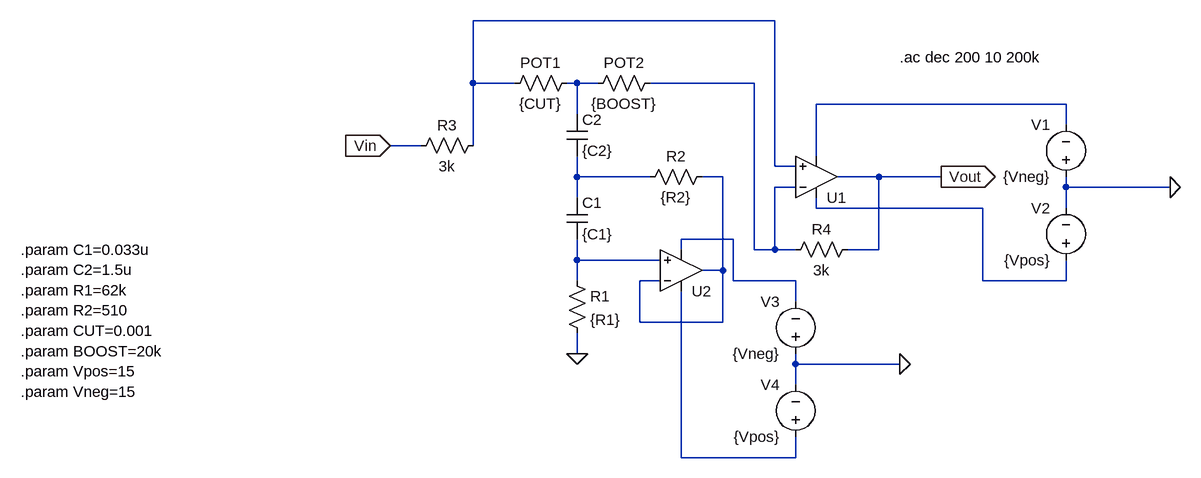
[diagram p0: schematic Equaliser.asc]
Equaliser.asc, the LTspice schematic file:
Version 4.1
SHEET 1 1188 680
WIRE 560 -96 96 -96
WIRE 96 0 96 -96
WIRE 160 0 96 0
WIRE 256 0 240 0
WIRE 288 0 256 0
WIRE 528 0 368 0
WIRE 1008 32 624 32
WIRE 256 48 256 0
WIRE 1008 64 1008 32
WIRE 16 96 -32 96
WIRE 96 96 96 0
WIRE 624 112 624 32
WIRE 560 128 560 -96
WIRE 592 128 560 128
WIRE 256 144 256 112
WIRE 368 144 256 144
WIRE 480 144 448 144
WIRE 720 144 656 144
WIRE 816 144 720 144
WIRE 592 160 560 160
WIRE 1008 160 1008 144
WIRE 1168 160 1008 160
WIRE 256 176 256 144
WIRE 624 192 624 176
WIRE 880 192 624 192
WIRE 1008 192 1008 160
WIRE 496 240 416 240
WIRE 416 256 416 240
WIRE 528 256 528 0
WIRE 560 256 560 160
WIRE 560 256 528 256
WIRE 592 256 560 256
WIRE 720 256 720 144
WIRE 720 256 672 256
WIRE 256 272 256 240
WIRE 384 272 256 272
WIRE 480 288 480 144
WIRE 480 288 448 288
WIRE 256 304 256 272
WIRE 384 304 352 304
WIRE 496 304 496 240
WIRE 592 304 496 304
WIRE 880 304 880 192
WIRE 1008 304 1008 272
WIRE 1008 304 880 304
WIRE 592 336 592 304
WIRE 352 368 352 304
WIRE 480 368 480 288
WIRE 480 368 352 368
WIRE 256 416 256 384
WIRE 592 432 592 416
WIRE 752 432 592 432
WIRE 592 464 592 432
WIRE 416 576 416 320
WIRE 592 576 592 544
WIRE 592 576 416 576
FLAG -32 96 Vin
IOPIN -32 96 In
FLAG 816 144 Vout
IOPIN 816 144 Out
FLAG 1168 160 0
FLAG 752 432 0
FLAG 256 416 0
SYMBOL res 112 80 R90
WINDOW 0 0 56 VBottom 2
WINDOW 3 32 56 VTop 2
SYMATTR InstName R3
SYMATTR Value 3k
SYMBOL res 256 -16 R90
WINDOW 0 0 56 VBottom 2
WINDOW 3 32 56 VTop 2
SYMATTR InstName POT1
SYMATTR Value {CUT}
SYMBOL res 384 -16 R90
WINDOW 0 0 56 VBottom 2
WINDOW 3 32 56 VTop 2
SYMATTR InstName POT2
SYMATTR Value {BOOST}
SYMBOL cap 240 48 R0
SYMATTR InstName C2
SYMATTR Value {C2}
SYMBOL cap 240 176 R0
SYMATTR InstName C1
SYMATTR Value {C1}
SYMBOL res 240 288 R0
SYMATTR InstName R1
SYMATTR Value {R1}
SYMBOL res 464 128 R90
WINDOW 0 0 56 VBottom 2
WINDOW 3 32 56 VTop 2
SYMATTR InstName R2
SYMATTR Value {R2}
SYMBOL OpAmps\\UniversalOpAmp2 416 288 M180
SYMATTR InstName U2
SYMATTR Value2 Avol=1Meg GBW=55Meg Slew=20
SYMATTR SpiceLine Ilimit=25m Rail=0.2 Vos=0.2m
SYMATTR SpiceLine2 En=2.7n Enk=20 In=0.4p Ink=100 Rin=1e9
SYMBOL OpAmps\\UniversalOpAmp2 624 144 M180
SYMATTR InstName U1
SYMATTR Value2 Avol=1Meg GBW=55Meg Slew=20
SYMATTR SpiceLine Ilimit=25m Rail=0.2 Vos=0.2m
SYMATTR SpiceLine2 En=2.7n Enk=20 In=0.4p Ink=100 Rin=1e9
SYMBOL res 688 240 R90
WINDOW 0 0 56 VBottom 2
WINDOW 3 32 56 VTop 2
SYMATTR InstName R4
SYMATTR Value 3k
SYMBOL voltage 1008 160 R180
WINDOW 0 24 96 Left 2
WINDOW 3 24 16 Left 2
SYMATTR InstName V1
SYMATTR Value {Vneg}
SYMBOL voltage 1008 288 R180
WINDOW 0 24 96 Left 2
WINDOW 3 24 16 Left 2
SYMATTR InstName V2
SYMATTR Value {Vpos}
SYMBOL voltage 592 432 R180
WINDOW 0 24 96 Left 2
WINDOW 3 24 16 Left 2
SYMATTR InstName V3
SYMATTR Value {Vneg}
SYMBOL voltage 592 560 R180
WINDOW 0 24 96 Left 2
WINDOW 3 24 16 Left 2
SYMATTR InstName V4
SYMATTR Value {Vpos}
TEXT 752 -40 Left 2 !.ac dec 200 10 200k
TEXT -600 256 Left 2 !.param C1=0.033u\n.param C2=1.5u\n.param R1=62k\n.param R2=510\n.param CUT=0.001\n.param BOOST=20k\n.param Vpos=15\n.param Vneg=15

The netlist it stands for:
* Equaliser.asc
R3 N001 Vin 3k
R§POT1 N002 N001 {CUT}
R§POT2 N003 N002 {BOOST}
C2 N002 N005 {C2}
C1 N005 N009 {C1}
R1 N009 0 {R1}
R2 N006 N005 {R2}
X§U2 N009 N006 N010 N008 N006 level2 Avol=1Meg GBW=55Meg Slew=20 Ilimit=25m Rail=0.2 Vos=0.2m En=2.7n Enk=20 In=0.4p Ink=100 Rin=1e9  ; pins In+ In- V+ V- OUT
X§U1 N001 N003 N007 N004 Vout level2 Avol=1Meg GBW=55Meg Slew=20 Ilimit=25m Rail=0.2 Vos=0.2m En=2.7n Enk=20 In=0.4p Ink=100 Rin=1e9  ; pins In+ In- V+ V- OUT
R4 Vout N003 3k
V1 0 N004 {Vneg}
V2 N007 0 {Vpos}
V3 0 N008 {Vneg}
V4 N010 0 {Vpos}
.ac dec 200 10 200k
.param C1=0.033u
.param C2=1.5u
.param R1=62k
.param R2=510
.param CUT=0.001
.param BOOST=20k
.param Vpos=15
.param Vneg=15
.lib UniversalOpAmp2.lib
.backanno
.end